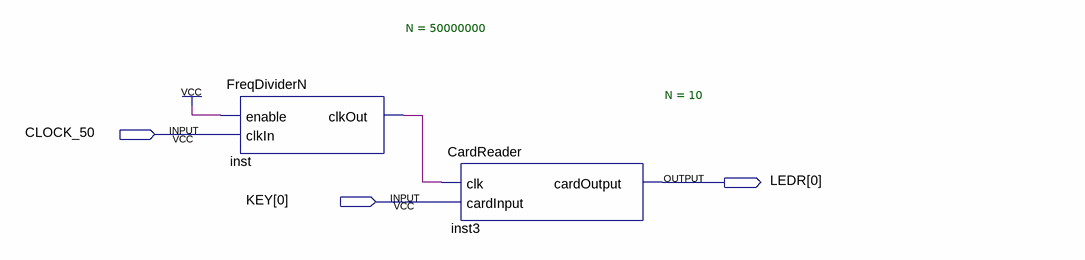
[diagram p0: schematic sheet]
// Quartus schematic CardReader_Demo.bdf as structural Verilog: 2 symbols, 3 pins
module CardReader_Demo (
  input  CLOCK_50,
  input  [0:0] KEY,
  output [0:0] LEDR
);

  wire inst_clkout;

  FreqDividerN #(.N(50000000)) inst (.enable(1'b1), .clkIn(CLOCK_50), .clkOut(inst_clkout));
  CardReader #(.N(10)) inst3 (.clk(inst_clkout), .cardInput(KEY[0]), .cardOutput(LEDR[0]));
endmodule
